# EAGLE design b (EAGLE 9.6.2)
Assembly variants: basic
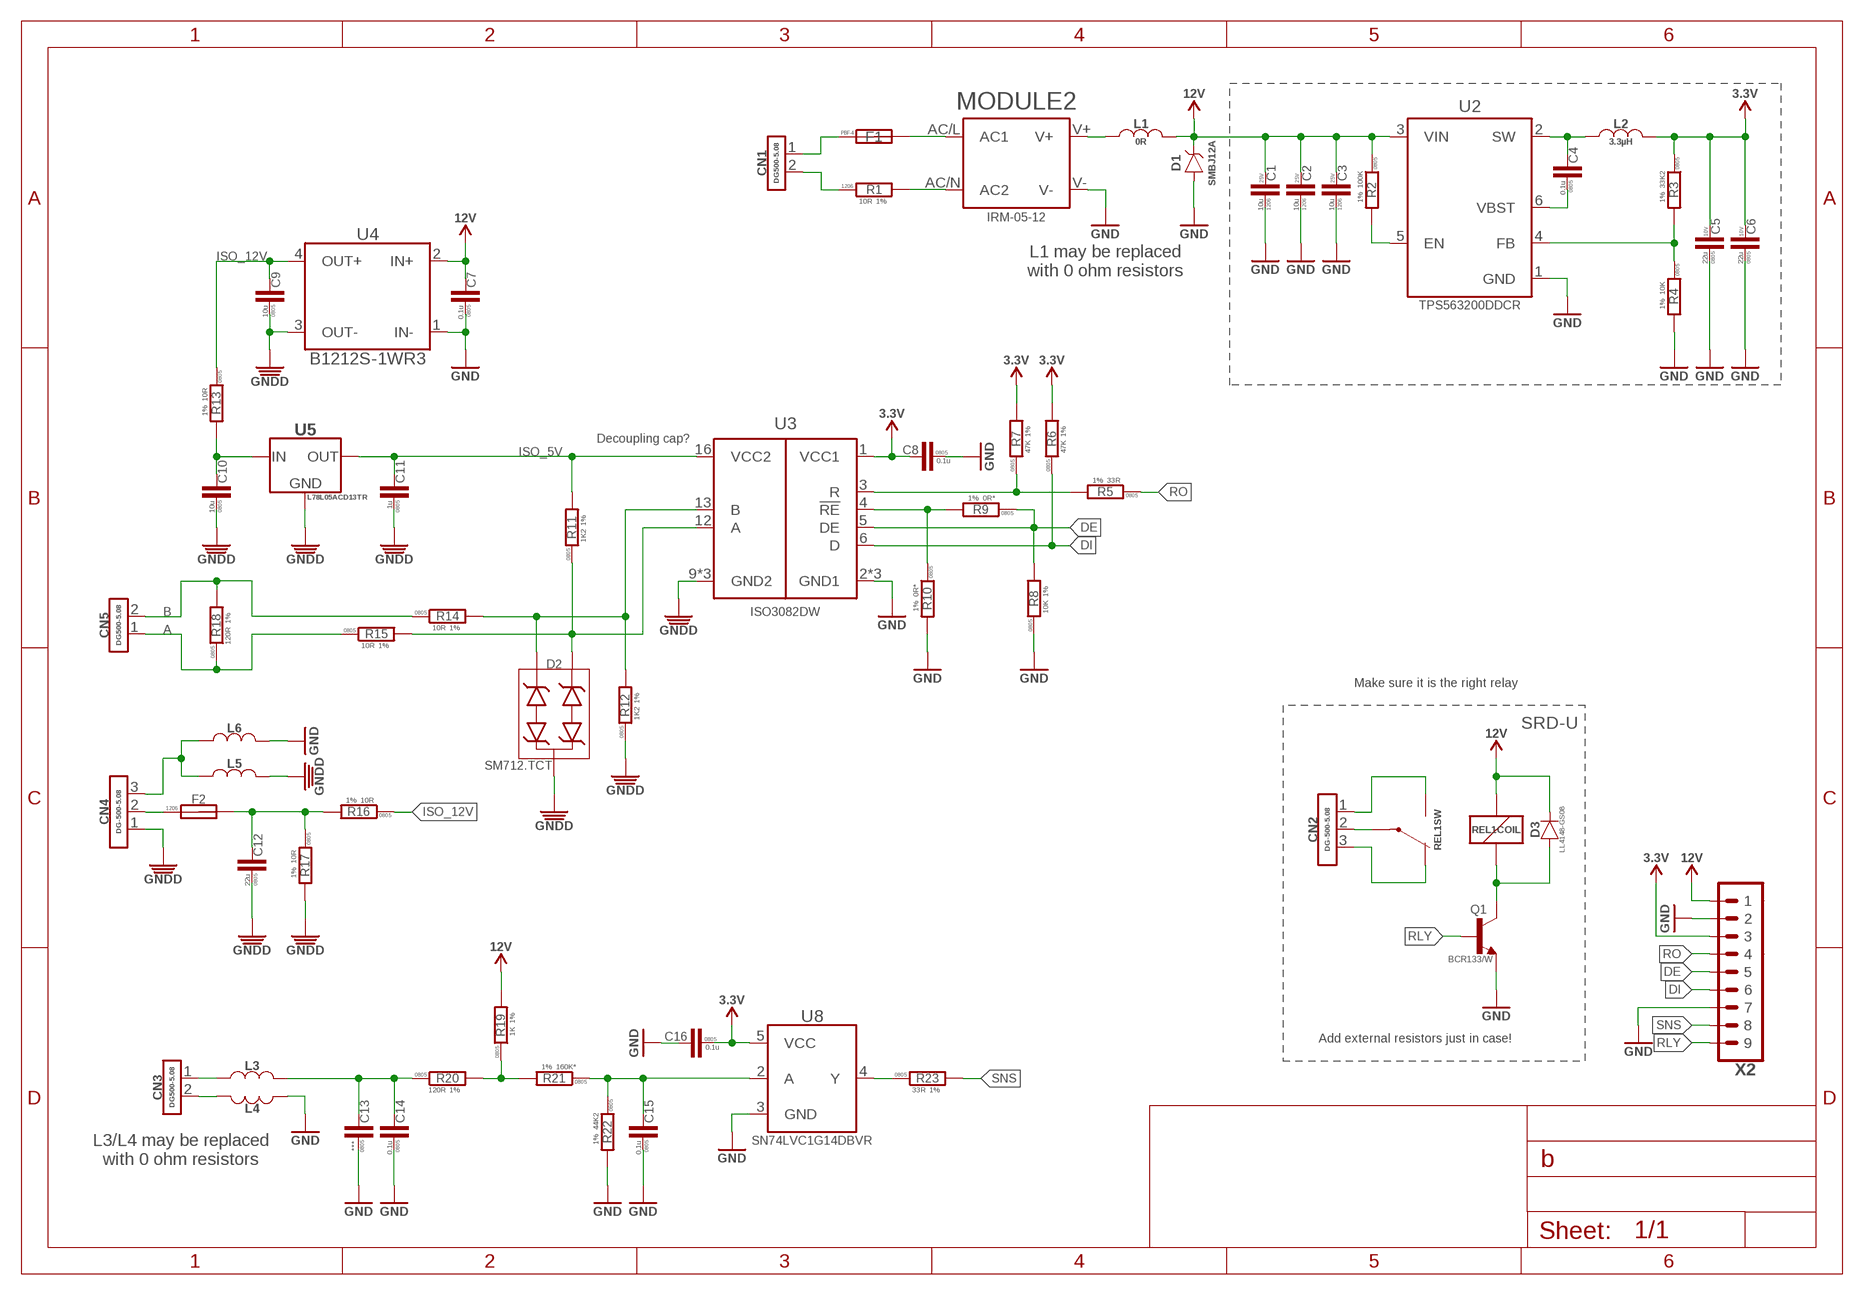
[diagram p0: schematic, sheet 1]

## Parts
C1  10u  C-1206  [C1206]
C2  10u  C-1206  [C1206]
C3  10u  C-1206  [C1206]
C4  0.1u  C-0805  [C0805]
C5  22u  C-0805  [C0805]
C6  22u  C-0805  [C0805]
C7  0.1u  C-0805  [C0805]
C8  0.1u  C-0805  [C0805]
C9  10u  C-0805  [C0805]
C10  10u  C-0805  [C0805]
C11  1u  C-0805  [C0805]
C12  22u  C-0805  [C0805]
C13  ***  C-0805  [C0805]  (not fitted in variant basic)
C14  0.1u  C-0805  [C0805]
C15  0.1u  C-0805  [C0805]
C16  0.1u  C-0805  [C0805]
CN1  CON-2P-DG500-5.08  [DG500-5.08-02P]
CN2  CON-3P-DG500-5.08  [DG500-5.08-03P]
CN3  CON-2P-DG500-5.08  [DG500-5.08-02P]
CN4  CON-3P-DG500-5.08  [DG500-5.08-03P]
CN5  CON-2P-DG500-5.08  [DG500-5.08-02P]
D1  SMBJ12A-SMB  [DO-214AA(SMB)]
D2  SM712  [SOT23B-3]
D3  LL4148  [LL-34]
F1  1.6A  FUSE-MST  [MST-FUSE]
F2  MF-NSMF050-2  FUSE-1206  [F1206]
L1  0R  L-0805  [L0805]
L2  3.3µH  3.3µH-VLS6045EX  [VLS6045EX]
L3  L-0805  [L0805]
L4  L-0805  [L0805]
L5  L-0805  [L0805]
L6  L-0805  [L0805]  (not fitted in variant basic)
MODULE2  IRM-05-12  [IRM-05]
Q1  BCR133  [SOT23B-3]
R1  10R  R-1%-1206  [R1206]
R2  100K  R-1%-0805  [R0805]
R3  33K2  R-1%-0805  [R0805]
R4  10K  R-1%-0805  [R0805]
R5  33R  R-1%-0805  [R0805]
R6  47K  R-1%-0805  [R0805]
R7  47K  R-1%-0805  [R0805]
R8  10K  R-1%-0805  [R0805]
R9  0R*  R-1%-0805  [R0805]
R10  0R*  R-1%-0805  [R0805]
R11  1K2  R-1%-0805  [R0805]
R12  1K2  R-1%-0805  [R0805]
R13  10R  R-1%-0805  [R0805]
R14  10R  R-1%-0805  [R0805]
R15  10R  R-1%-0805  [R0805]
R16  10R  R-1%-0805  [R0805]
R17  10R  R-1%-0805  [R0805]
R18  120R  R-1%-0805  [R0805]
R19  1K  R-1%-0805  [R0805]
R20  120R  R-1%-0805  [R0805]
R21  160K*  R-1%-0805  [R0805]
R22  44K2  R-1%-0805  [R0805]
R23  33R  R-1%-0805  [R0805]
REL1  RELAY_SPDTHJR-3FF-SH  [HJR-3FF-12VDC-S-Z]
U2  TPS563200  [SOT23-6]
U3  ISO3082  [SO-16W]
U4  B1212S-1WR3  [SIP-4]
U5  L78L05ACD13TR  [SOIC8]
U8  74LVC1G14DBV  [SOT23-5]
X2  PINHEAD_1X09-2.54-TH-MALE  [1X09-PTH-2.54]

## Nets
3490587: R5.2 R7.1 U3.3(R)
+12V: CN4.2 F2.P$1
A: CN5.1 R15.1 R18.1
B: CN5.2 R14.1 R18.2
DE: R8.2 R9.1 U3.5(DE) X2.5
DI: R6.1 U3.6(D) X2.6
GND: C1.P$1 C2.P$1 C3.P$1 C5.1 C6.1 C7.1 C8.1 C13.1 C14.1 C15.1 C16.2 D1.A L4.2 L6.1 MODULE2.V- Q1.2(E) R4.2 R8.1 R10.2 R22.2 U2.1(GND) U3.2(GND1) U3.7(GND1) U3.8(GND1) U4.1(IN-) U8.3(GND) X2.2 X2.7
GNDD: C9.1 C10.1 C11.1 C12.1 CN4.1 D2.3 L5.2 R12.1 R17.2 U3.9(GND2) U3.10(GND2) U3.15(GND2) U4.3(OUT-) U5.2(GND) U5.3(GND) U5.6(GND) U5.7(GND)
ISO_5V: C11.2 R11.2 U3.16(VCC2) U5.1(OUT)
ISO_12V: C9.2 R13.1 R16.1 U4.4(OUT+)
N$1: CN4.3 L5.1 L6.2
N$2: MODULE2.AC/N(AC2) R1.P$2
N$3: D2.2(C2) R11.1 R15.2 U3.12(A)
N$4: D2.1(C3) R12.2 R14.2 U3.13(B)
N$5: F1.2 MODULE2.AC/L(AC1)
N$6: L1.1 MODULE2.V+
N$7: C4.1 U2.6(VBST)
N$8: R9.2 R10.1 U3.4(!RE)
N$9: CN1.1 F1.1
N$10: CN1.2 R1.P$1
N$11: R2.2 U2.5(EN)
N$12: C4.2 L2.P$1 U2.2(SW)
N$13: R3.2 R4.1 U2.4(FB)
N$14: CN2.2 REL1.1(SW:COM)
N$15: CN2.3 REL1.4(SW:NC)
N$16: CN2.1 REL1.3(SW:NO)
N$17: CN3.1 L3.1
N$18: CN3.2 L4.1
N$19: C13.2 C14.2 L3.2 R20.1
N$20: C10.2 R13.2 U5.8(IN)
N$21: R19.1 R20.2 R21.2
N$22: C15.2 R21.1 R22.1 U8.2(A)
N$23: D3.A Q1.3(C) REL1.5
N$24: R23.1 U8.4(Y)
N$25: C12.2 F2.P$2 R16.2 R17.1
RLY: Q1.1(B) X2.9
RO: R5.1 X2.4
SNS: R23.2 X2.8
VDD_3V3: C5.2 C6.2 C8.2 C16.1 L2.P$2 R3.1 R6.2 R7.2 U3.1(VCC1) U8.5(VCC) X2.3 ; supply symbol labelled 3.3V
VDD_12V: C1.P$2 C2.P$2 C3.P$2 C7.2 D1.C D3.C L1.2 R2.1 R19.2 REL1.2 U2.3(VIN) U4.2(IN+) X2.1 ; supply symbol labelled 12V

## Notes on the sheet
- L1 may be replaced
  with 0 ohm resistors
- Decoupling cap?
- Make sure it is the right relay
- SRD-U
- Add external resistors just in case!
- L3/L4 may be replaced
  with 0 ohm resistors

## Library data of the parts
C1-C3 = rc:C; PACKAGE: 1206; VOLTAGE: 25V
C4 C7-C16 = rc:C; PACKAGE: 0805
C5 C6 = rc:C; PACKAGE: 0805; VOLTAGE: 10V
CN1 CN3 CN5 = degson:CON-2P; MANF: Degson Electronics; MANF#: DG-500-5.08-02P-14; TYPE: DG500-5.08
CN2 CN4 = degson:CON-3P; MANF: Degson Electronics; MANF#: DG-500-5.08-03P-14; TYPE: DG-500-5.08
D1 = TVS_diodes:SMBJ12A: 30.2A 19.9V 13.3V 12V Unidirectional SMB(DO-214AA) TVS ROHS; LCSC#: C151251; MANF: Littelfuse; MANF#: SMBJ12A
D2 = TVS_diodes:SM712: TVS DIODE 12VWM/7VWM SOT23; DIGIKEY#: SM712-TPMSCT-ND; LCSC#: C12067; MANF: Semtech Corporation; MANF#: SM712.TCT
D3 = Diodes:LL4148: Small Signal Diode; MANF: VISHAY INTERTECHNOLOGY INC; MANF#: LL4148-GS08
F1 = rc:FUSE; MANF: Multicomp; MANF#: MST 1.6A 250V; PACKAGE: PBF-4
F2 = rc:FUSE; MANF: Bourns; MANF#: MF-NSMF050-2; PACKAGE: 1206
L1 L3-L6 = rc:L
L2 = power_inductors:3.3µH; MANF: TDK Corporation; MANF#: VLS6045EX-3R3N
MODULE2 = ac-dc:IRM-05-12: 5W AC-DC High Reliable PCB-Mount Green Industrial Power Module; MANF: Meanwell; MANF#: IRM-05-12
Q1 = misc:BCR133: NPN Silicon Digital Transistor; MANF: INFINEON TECHNOLOGIES AG.; MANF#: BCR133/W
R1 = rc:R; PACKAGE: 1206; TOLERANCE: 1%
R2-R23 = rc:R; PACKAGE: 0805; TOLERANCE: 1%
REL1 = misc:RELAY_SPDT; MANF: Xiamen Hongfa Electroacoustic Co.Ltd; MANF#: HF3FA/012-ZST
U2 = dc-dc:TPS563200: TPS56x200 4.5-V To 17-V Input, 2-A, 3-A Synchronous Step-Down Voltage Regulator In6 Pin SOT-23 datasheet <https://static.chipdip.ru/lib/786/DOC059786447.pdf>; MANF: Texas Instruments; MANF#: TPS563200DDCR
U3 = serial_interfaces:ISO3082: ISO308x Isolated 5-V Full- and Half-Duplex RS-485 Transceivers; MANF: Texas Instruments; MANF#: ISO3082DW
U4 = dc-dc:B1212S-1WR3: 1W, Fixed input voltage, isolated & unregulated single output dc-dc converter; MANF: Mornsun Power; MANF#: B1212S-1WR3
U5 = linear regulators:L78L05ACD13TR: Linear Voltage Regulator IC 1 Output 100mA 8-SO; DIGIKEY#: 497-1182-1-ND; MANF: STMicroelectronics; MANF#: L78L05ACD13TR
U8 = misc:74LVC1G14DBV: SINGLE SCHMITT-TRIGGER INVERTER; MANF: Texas Instruments; MANF#: SN74LVC1G14DBVR
X2 = pinhead:PINHEAD_1X09

## Board
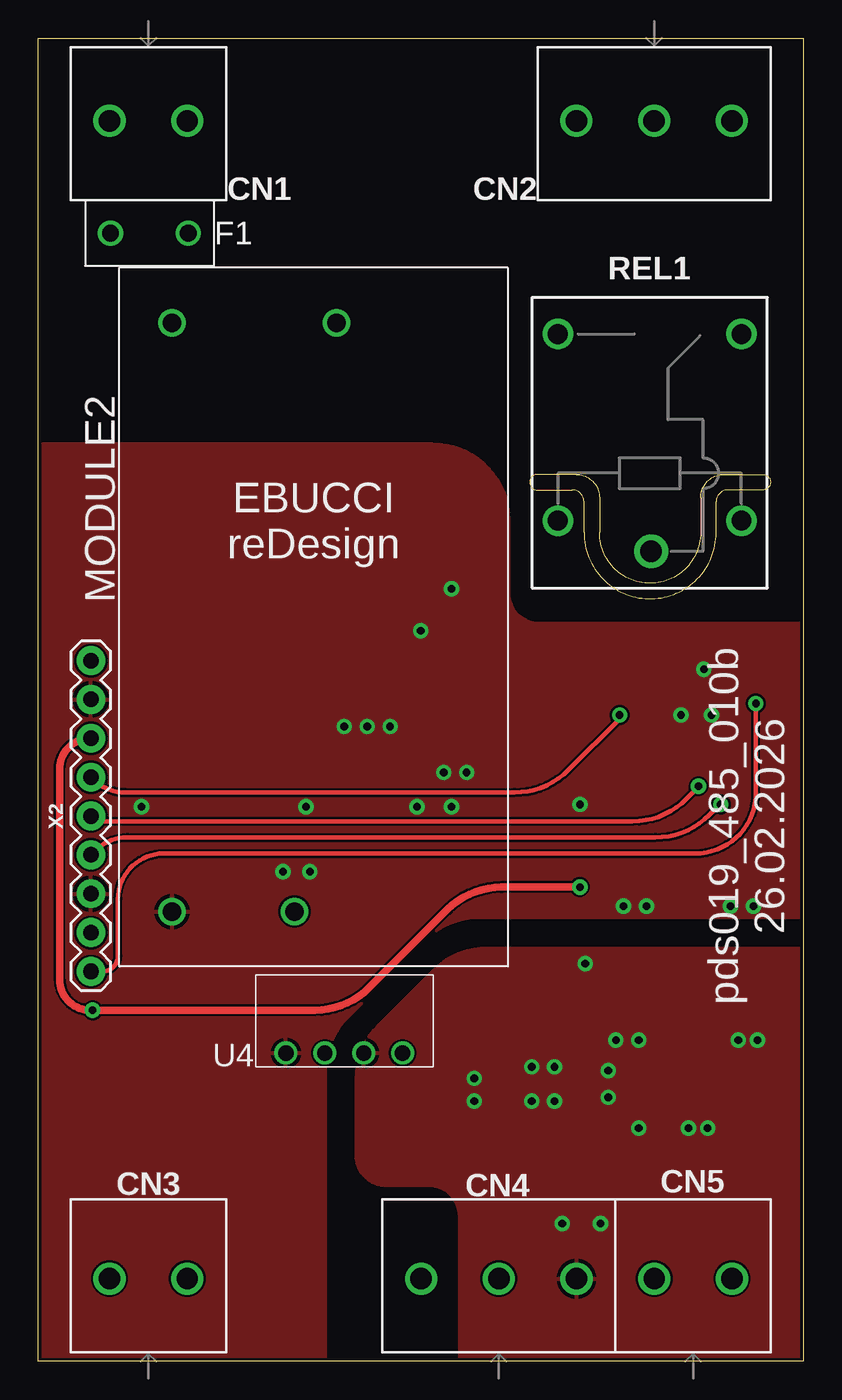
[diagram p1: board, top side]
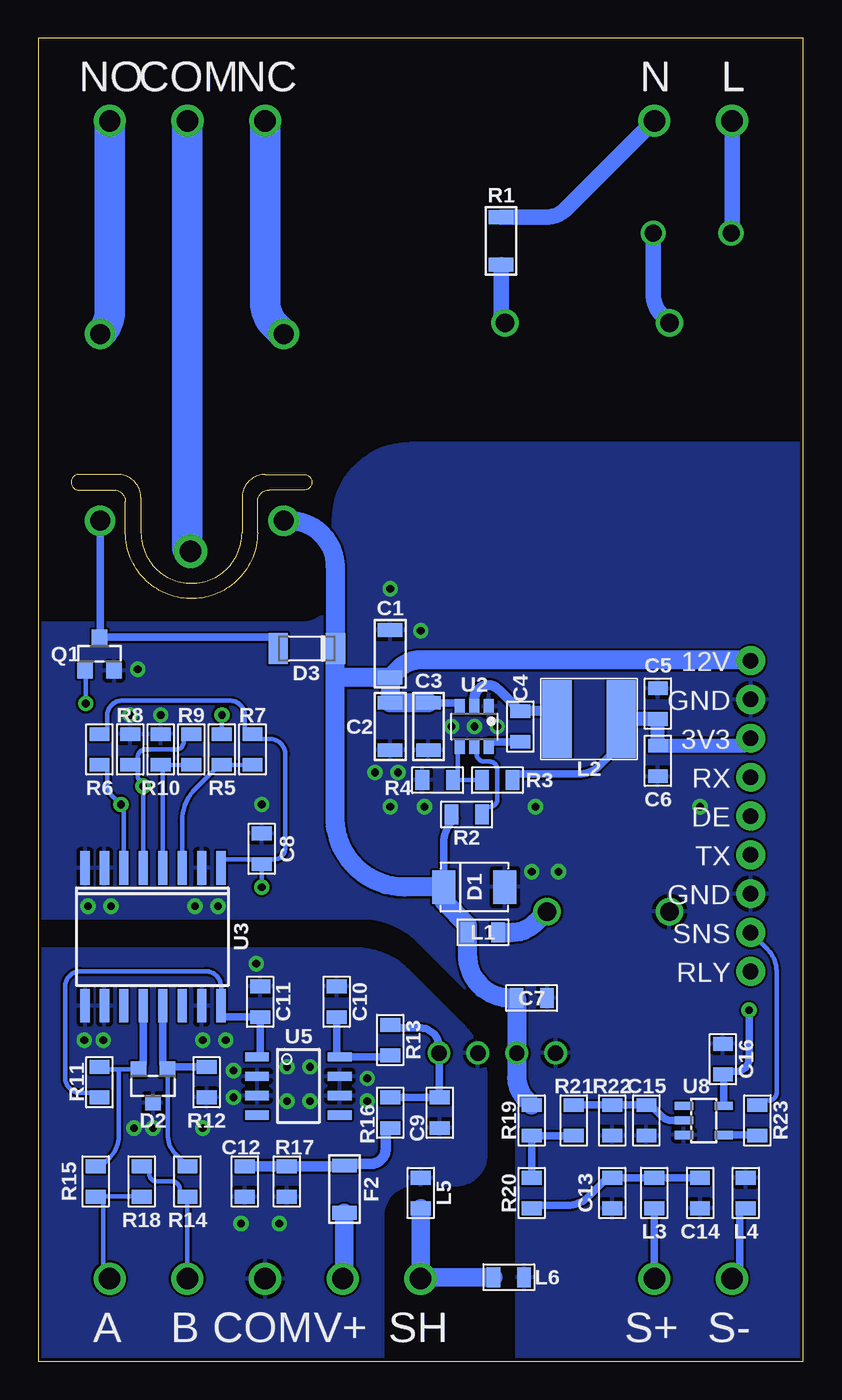
[diagram p2: board, bottom side, seen from below]

Size 50 x 86.5 mm. Coordinates in mm from the lower left corner, seen from the top.
Copper layers (1*16): Top 0.035mm / dielectric 1.5mm / Bottom 0.035mm
Design rules "JLCPCB 2 layer": minimum track width 6mil, minimum drill 0.3mm, track to track 0.15mm, track to pad 0.15mm, pad to pad 0.15mm, via to via 0.15mm, smd to smd 0.1mm, copper to edge 0.2mm, drill to drill 6mil, minimum pad ring 0.15mm, minimum via ring 0.15mm, stop-mask expansion 0.05mm, vias tented up to drill 0.5mm, thermal gap 10mil

### Footprints (pad centres in the part's own frame; a part is rotated, then mirrored left to right if it is on the bottom)
C1206 = smd 0.9 x 1.6: P$1 -1.55,0; P$2 1.55,0
C0805 = smd 0.9 x 1.3: 1 -1,0; 2 1,0
DG500-5.08-02P = drill 1.4: 1 -2.54,0; 2 2.54,0
DG500-5.08-03P = drill 1.4: 1 -5.08,0; 2 0,0; 3 5.08,0
DO-214AA(SMB) = smd 1.5 x 2.2: A -2,0; C 2,0
SOT23B-3 = smd 1 x 1: 1 -0.95,-1.1; 2 0.95,-1.1; 3 0,1.1
LL-34 = smd 1.25 x 2: A -1.875,0; C 1.875,0
MST-FUSE = drill 1.1: 1 -2.54,0; 2 2.54,0
F1206 = smd 0.9 x 1.6: P$1 -1.55,0; P$2 1.55,0
L0805 = smd 0.9 x 1.3: 1 -1,0; 2 1,0
VLS6045EX = smd 1.9 x 5.1: P$1 -2.1,0; P$2 2.1,0
IRM-05 = drill 1.2: AC/L 19.25,9.25; AC/N 19.25,-1.5; V+ -19.25,1.25; V- -19.25,9.25
R1206 = smd 0.9 x 1.6: P$1 -1.55,0; P$2 1.55,0
R0805 = smd 0.9 x 1.3: 1 -1,0; 2 1,0
HJR-3FF-12VDC-S-Z = drill 1.4 pad 2.2: 1 7.1,0.1 | drill 1.3 pad 2: 2 5.1,-6; 3 -7.1,-6; 4 -7.1,6; 5 5.1,6
SOT23-6 = smd 1 x 0.65: 1 1.3,-0.95; 2 1.3,0; 3 1.3,0.95; 4 -1.3,0.95; 5 -1.3,0; 6 -1.3,-0.95
SO-16W = smd 2.2 x 0.6: 1 -4.5,4.445; 2 -4.5,3.175; 3 -4.5,1.905; 4 -4.5,0.635; 5 -4.5,-0.635; 6 -4.5,-1.905; 7 -4.5,-3.175; 8 -4.5,-4.445; 9 4.5,-4.445; 10 4.5,-3.175; 11 4.5,-1.905; 12 4.5,-0.635; 13 4.5,0.635; 14 4.5,1.905; 15 4.5,3.175; 16 4.5,4.445
SIP-4 = drill 1 pad 1.5: 1 -3.81,-2.1; 2 -1.27,-2.1; 3 1.27,-2.1; 4 3.81,-2.1
SOIC8 = smd 0.6 x 1.55: 1 -1.905,-2.7; 2 -0.635,-2.7; 3 0.635,-2.7; 4 1.905,-2.7; 5 1.905,2.7; 6 0.635,2.7; 7 -0.635,2.7; 8 -1.905,2.7
SOT23-5 = smd 1.2 x 0.55: 1 1.3,-0.95; 2 1.3,0; 3 1.3,0.95; 4 -1.3,0.95; 5 -1.3,-0.95
1X09-PTH-2.54 = drill 1.016 pad 1.88: 1 -10.16,0; 2 -7.62,0; 3 -5.08,0; 4 -2.54,0; 5 0,0; 6 2.54,0; 7 5.08,0; 8 7.62,0; 9 10.16,0

### Placement (x,y rotation side)
C1  27,46.25 270 bottom
C2  27,41.5 90 bottom
C3  24.5,41.5 90 bottom
C4  18.5,41.5 90 bottom
C5  9.5,43 270 bottom
C6  9.5,39.25 90 bottom
C7  17.75,23.75 180 bottom
C8  35.4,33.5 270 bottom
C9  23.75,16.25 90 bottom
C10  30.5,23.5 270 bottom
C11  35.5,23.5 270 bottom
C12  36.5,11.75 90 bottom
C13  12.5,11 90 bottom  (not fitted)
C14  6.75,11 90 bottom
C15  10.25,15.75 90 bottom
C16  5.25,19.75 90 bottom
CN1  7.2,81.1 0 top
CN2  40.25,81.1 0 top
CN3  7.2,5.4 180 top
CN4  30.1,5.4 180 top
CN5  42.8,5.4 180 top
D1  21.5,31 180 bottom
D2  42.5,18 180 bottom
D3  32.45,46.6 0 bottom
F1  7.26,73.75 0 top
F2  30,11.25 90 bottom
L1  20.95,28.05 180 bottom
L2  14,42 0 bottom
L3  9.75,11 90 bottom
L4  3.75,11 90 bottom
L5  25,11 90 bottom
L6  19.25,5.5 180 bottom  (not fitted)
MODULE2  18,48.65 90 top
Q1  46,46.25 0 bottom
R1  19.75,73.25 270 bottom
R2  22,35.75 0 bottom
R3  20,38 180 bottom
R4  23.9,38 180 bottom
R5  38,40 270 bottom
R6  46,40 90 bottom
R7  36,40 90 bottom
R8  44,40 270 bottom
R9  40,40 270 bottom
R10  42,40 90 bottom
R11  46,18.25 270 bottom
R12  39,18.25 90 bottom
R13  27,21 270 bottom
R14  40.25,11.75 90 bottom
R15  46.25,11.75 90 bottom
R16  27,16.25 270 bottom
R17  33.75,11.75 270 bottom
R18  43.25,11.75 90 bottom
R19  17.75,15.75 90 bottom
R20  17.75,11 90 bottom
R21  15,15.75 270 bottom
R22  12.5,15.75 270 bottom
R23  3,15.75 90 bottom
REL1  39.96,60.06 270 top
U2  21.5,41.5 90 bottom
U3  42.5,27.75 270 bottom
U4  20,22.25 0 top
U5  33,18 270 bottom
U8  6.5,15.75 180 bottom
U$1  [REF_B]  0,0 0 top
X2  3.44,35.65 270 top

### Tracks (layer width: path | path; a pad name or v marks a point on that pad's centre or on a via)
3490587
  Bottom 0.3: U3.3 40.59,35.31 arc45 39.72,37.43 38.5,38.65 38.5,39 R5.2 R7.1
+12V
  Bottom 1.2: F2.P$1 30,5.5 CN4.2
A
  Bottom 0.3: R18.1 43.3,10.8 46.2,10.8 R15.1 45.74,10.75 45.74,5.8 CN5.1
B
  Bottom 0.3: R18.2 42.75,12.75 42.75,12.25 arc-90 42.25,11.75 41.25,11.75 arc90 40.75,11.25 40.75,10.75 R14.1 CN5.2
DE  (via drill 0.5 pad 1)
  Top 0.3: X2.5 arc45 4.29,35.3 38.83,35.3 arc45 42.36,36.76 43.15,37.55 v43.15,37.6
  Bottom 0.3: U3.5 43.13,37.59 v43.15,37.6 43.21,37.66 arc45 43.5,38.36 43.5,39 | 43.5,39 43.5,39.5 arc90 43,40 41,40 arc-90 40.5,40.5 40.5,41 R9.1 | R8.2 43.5,39
DI  (via drill 0.5 pad 1)
  Top 0.3: X2.6 3.7,33.37 arc-45 5.82,34.25 40.33,34.25 arc45 43.86,35.71 44.55,36.4 v44.6,36.4
  Bottom 0.3: R6.1 45.5,39 45.5,37.71 arc-45 45.21,37.01 v44.6,36.4 44.41,36.2 U3.6
GND  (via drill 0.5 pad 1)
  other vias: 21.5,41.5 20,41.5 23,41.5 26.5,38.5 28,38.5 25,47.75 35.4,36.4 27,50.5 24.75,36.25 17.5,36.25 6.75,36.25 17.75,32 16,32 39.75,29.75 38.25,29.75 46.75,29.75 45.25,29.75 44,42.25 42,42.25 43.5,45.25 27,36.25
  pour Bottom: 0,60 25.75,60 arc-90 30.75,55 30.75,50.25 arc90 32.75,48.25 50,48.25 50,29 28.82,29 arc45 25.29,27.54 20.21,22.46 arc45 18.75,18.93 18.75,0 0,0
  pour Top: 0,60 25.75,60 arc-90 30.75,55 30.75,50.25 arc90 32.75,48.25 50,48.25 50,29 28.82,29 arc45 25.29,27.54 20.21,22.46 arc45 18.75,18.93 18.75,0 0,0
GNDD  (via drill 0.5 pad 1)
  other vias: 45.75,21 47,21 39.25,21 37.75,21 35.75,26 28.5,18.5 28.5,17 37.25,17.25 37.25,19 33.75,19.25 33.75,17 32.25,17 32.25,19.25 43.75,15.25 42.5,15.25 39.25,15.25 36.75,9 34.25,9
  pour Bottom: 50,0 50,27 29.32,27 arc45 25.79,25.54 22.21,21.96 arc45 20.75,18.43 20.75,13.5 arc90 22.75,11.5 25.5,11.5 arc-90 27.5,9.5 27.5,0
  pour Top: 50,0 50,27 29.32,27 arc45 25.79,25.54 22.21,21.96 arc45 20.75,18.43 20.75,13.5 arc90 22.75,11.5 25.5,11.5 arc-90 27.5,9.5 27.5,0
ISO_5V
  Bottom 0.3: R11.2 46.3,17.55 47.25,17.55 arc90 48.25,18.55 48.25,24.5 arc90 47.25,25.5 39.05,25.5 arc90 38.05,24.5 U3.16
  Bottom 0.5: U5.1 35.5,20.11 C11.2 38.05,22.5 U3.16
ISO_12V
  Bottom 0.5: R13.1 26.8,21.8 25.06,21.8 arc90 23.81,20.55 U4.4 23.81,17.31 C9.2 R16.1
N$1
  Bottom 1.2: L6.2 24.92,5.5 | 24.92,5.5 CN4.3 | L5.1 25,5.58 24.92,5.5
N$2
  Bottom 1: R1.P$2 19.75,68.14 MODULE2.AC/N
N$3
  Bottom 0.3: D2.2 44.75,19.1 | 44.75,19.1 45.85,19.1 R11.1 | R15.2 45.9,12.75 45.34,13.31 arc-45 44.75,14.73 44.75,19.1
  Bottom 0.5: D2.2 43.15,19.4 43.15,23.23 U3.12
N$4
  Bottom 0.3: R14.2 40.96,13.46 arc45 41.55,14.88 D2.1
  Bottom 0.5: U3.13 41.87,19.41 D2.1 41.4,19.25 R12.2
N$5
  Bottom 1: F1.2 9.8,69.77 arc-45 9.21,68.35 MODULE2.AC/L
N$6
  Bottom 1.25: L1.1 18.98,28.05 arc-45 17.56,28.64 MODULE2.V+
N$7
  Bottom 0.5: C4.1 20.55,40.5 U2.6
N$8
  Bottom 0.3: U3.4 41.87,38.87 R10.1 R9.2
N$9
  Bottom 1: CN1.1 4.66,73.81 F1.1
N$10
  Bottom 1: CN1.2 15.49,75.35 arc45 16.81,74.8 R1.P$1
N$11
  Bottom 0.3: U2.5 21.35,40.05 21.35,39.7 arc-90 20.85,39.2 20.5,39.2 arc90 20,38.7 20,36.75 arc90 20.5,36.25 21,36.25 R2.2
N$12
  Bottom 0.65: U2.2 21.5,43.29 arc135 19.94,43.94 C4.2 16.6,42.5 L2.P$1
N$13
  Bottom 0.3: R3.2 R4.1 22.6,38.3 22.6,40.05 U2.4
N$14
  Bottom 2: CN2.2 40.25,53.15 REL1.1
N$15
  Bottom 2: CN2.3 45.33,68.62 arc45 45.92,67.2 REL1.4
N$16
  Bottom 2: CN2.1 35.17,69.2 arc-45 34.58,67.78 REL1.3
N$17
  Bottom 0.5: CN3.1 L3.1
N$18
  Bottom 0.5: L4.1 4.15,10 4.15,5.85 4.6,5.4 CN3.2
N$19
  Bottom 0.5: R20.1 17.55,10.2 15.43,10.2 arc-45 14.01,10.79 12.8,12 C13.2 L3.2 C14.2
N$20
  Bottom 0.5: R13.2 27.09,19.91 U5.8 30.5,20.11 C10.2
N$21
  Bottom 0.5: R20.2 R19.1 R21.2
N$22
  Bottom 0.5: R21.1 R22.1 C15.2 10,16.75 9.29,16.04 arc-45 8.59,15.75 U8.2
N$23
  Bottom 0.5: REL1.5 45.96,47.39 Q1.3 34.33,47.35 D3.A
N$24
  Bottom 0.5: U8.4 3.05,14.8 R23.1
N$25
  Bottom 0.7: C12.2 R17.1 30.05,12.75 F2.P$2 29.9,12.9 28.3,12.9 arc-90 27.3,13.9 27.3,15.25 R16.2
RLY  (via drill 0.5 pad 1)
  Top 0.3: X2.9 4.2,25.49 arc90 5.2,26.49 5.2,30.2 arc-90 8.2,33.2 42.95,33.2 arc90 46.9,37.15 v46.9,43
  Bottom 0.3: v46.9,43 46.9,45.1 Q1.1
RO  (via drill 0.5 pad 1)
  Top 0.3: X2.4 3.56,38.07 arc45 5.68,37.19 31.12,37.19 arc45 34.65,38.65 38,42 v38,42.25
  Bottom 0.3: R5.1 v38,42.25
SNS
  Bottom 0.3: X2.8 2.34,26.93 arc45 1.75,25.51 1.75,17.55 arc90 2.25,17.05 2.7,17.05 R23.2
VDD_3V3  (via drill 0.5 pad 1)
  Top 0.5: v35.4,31 30.27,31 arc45 26.74,29.54 21.61,24.41 arc-45 18.08,22.95 v3.55,22.95 3.4,22.95 arc-90 1.4,24.95 1.4,38.73 arc-90 3.4,40.73 X2.3
  Bottom 0.3: R6.2 45.5,41 45.5,42.2 arc90 44.5,43.2 37.5,43.2 arc90 36.5,42.2 36.5,41 R7.2 36,40.7 34.9,40.7 arc90 33.85,39.65 33.85,33.6 arc90 34.65,32.8 35.4,32.8 | U3.1 38.05,32.8 35.4,32.8 | 35.4,32.8 C8.2 v35.4,31
  Bottom 0.5: U8.5 5.2,18.7 C16.1 5.05,18.95 4.4,18.95 arc-90 3.55,19.8 v3.55,22.95 | R3.1 19,38.4 14.68,38.4 arc-45 13.26,38.99 11.9,40.35 L2.P$2
  Bottom 0.9: L2.P$2 C5.2 C6.2 3.92,40.25 X2.3
VDD_12V
  Bottom 0.5: U2.3 22.45,43.05 C3.P$2 | R2.1 22.75,35.5 22.91,35.34 arc-45 23.5,33.92 D1.C
  Bottom 1.25: X2.1 3.44,45.86 25.01,45.86 arc-45 26.43,45.27 C1.P$2 | R19.2 18.14,17.14 arc45 18.73,18.56 U4.2 18.73,23.73 C7.2 19.15,23.75 arc90 21.95,26.55 L1.2 21.95,28.5 23.5,30.05 D1.C 26.05,31 arc90 30.6,35.55 30.6,44.5 | REL1.2 33.6,54.96 arc90 30.6,51.96 30.6,46.62 D3.C 30.6,46.58 30.6,44.5 | C3.P$2 C2.P$2 C1.P$2 | C1.P$2 30.4,44.7 30.6,44.5

### Text on the board
tPlace: EBUCCI / reDesign | pds019_485_010b / 26.02.2026
bPlace: L | N | NC | COM | NO | 12V | GND | 3V3 | RX | DE | TX | GND | SNS | RLY | S- | S+ | SH | V+ | COM | B | A
Notes: 2 layer PCB / Copper thickness 35 uM / Soldermask color blue / PCB thickness 1.5 mm